# EAGLE design ltc (EAGLE 6.5.0)
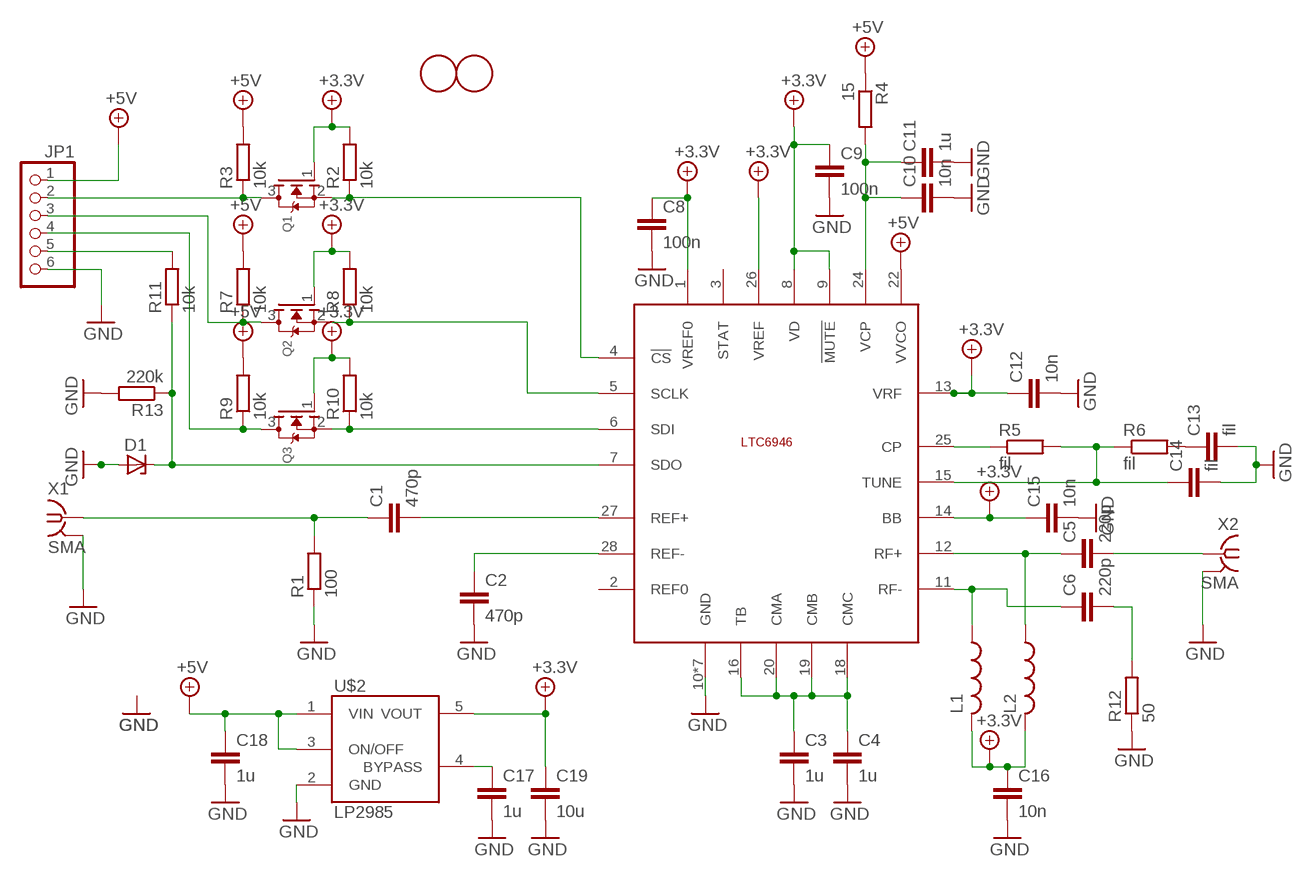
[diagram p0: schematic, sheet 1]

## Parts
C1  470p  C-EUC0603  [C0603]
C2  470p  C-EUC0603  [C0603]
C3  1u  C-EUC0603  [C0603]
C4  1u  C-EUC0603  [C0603]
C5  220p  C-EUC0603  [C0603]
C6  220p  C-EUC0603  [C0603]
C8  100n  C-EUC0603  [C0603]
C9  100n  C-EUC0603  [C0603]
C10  10n  C-EUC0603  [C0603]
C11  1u  C-EUC0603  [C0603]
C12  10n  C-EUC0603  [C0603]
C13  fil  C-EUC0603  [C0603]
C14  fil  C-EUC0603  [C0603]
C15  10n  C-EUC0603  [C0603]
C16  10n  C-EUC0603  [C0603]
C17  1u  C-EUC0603  [C0603]
C18  1u  C-EUC0603  [C0603]
C19  10u  C-EUC0603  [C0603]
D1  ZENER-DIODESOT23  [SOT23]
JP1  PINHD-1X6B  [1X06-BIG]
L1  L-USL2825P  [L2825P]
L2  L-USL2825P  [L2825P]
Q1  MOSFET-NREFLOW  [SOT23]
Q2  MOSFET-NREFLOW  [SOT23]
Q3  MOSFET-NREFLOW  [SOT23]
R1  100  R-EU_R0603  [R0603]
R2  10k  R-EU_R0603  [R0603]
R3  10k  R-EU_R0603  [R0603]
R4  15  R-EU_R0603  [R0603]
R5  fil  R-EU_R0603  [R0603]
R6  fil  R-EU_R0603  [R0603]
R7  10k  R-EU_R0603  [R0603]
R8  10k  R-EU_R0603  [R0603]
R9  10k  R-EU_R0603  [R0603]
R10  10k  R-EU_R0603  [R0603]
R11  10k  R-EU_R0603  [R0603]
R12  50  R-EU_R0603  [R0603]
R13  220k  R-EU_R0603  [R0603]
U$1  LTC6946  [QFN28-UFD]
U$2  LP2985AIM5-3.3  [SOT25]
U$3  FIDUCIAL  [FIDUCIAL_1MM]
U$4  FIDUCIAL  [FIDUCIAL_1MM]
X1  SMA  SMA-142-0711-821/826  [J502-ND-142-0711-821/826]
X2  SMA  SMA-142-0711-821/826  [J502-ND-142-0711-821/826]

## Nets
+4.1V: C8.1 C9.1 C12.1 C15.1 C16.1 C19.1 L1.2 L2.2 Q1.1(G) Q2.1(G) Q3.1(G) R2.2 R8.2 R10.2 U$1.1(VREF0) U$1.8(VD) U$1.9(!MUTE) U$1.13(VRF) U$1.14(BB) U$1.26(VREF) U$2.5(VOUT) ; supply symbol labelled +3.3V
+5V: C18.1 JP1.1 R3.2 R4.1 R7.2 R9.2 U$1.22(VVCO) U$2.1(VIN) U$2.3(ON/OFF)
BYPASS: C17.1 U$2.4(BYPASS)
GND: C2.2 C3.2 C4.2 C8.2 C9.2 C10.2 C11.2 C12.2 C13.2 C14.2 C15.2 C16.2 C17.2 C18.2 C19.2 D1.1(A) JP1.6 R1.1 R12.1 R13.2 U$1.10(GND) U$1.17(GND) U$1.21(GND) U$1.23(GND) U$1.29(GND) U$1.29@1(GND) U$1.29@2(GND) U$2.2(GND) X1.G@1 X1.G@2 X1.G@3 X1.G@4 X2.G@1 X2.G@2 X2.G@3 X2.G@4
N$1: C2.1 U$1.28(REF-)
N$2: C1.2 U$1.27(REF+)
N$3: C1.1 R1.2 X1.1
N$4: C3.1 C4.1 U$1.16(TB) U$1.18(CMC) U$1.19(CMB) U$1.20(CMA)
N$5: C6.2 R12.2
N$6: Q1.2(S) R2.1 U$1.4(!CS)
N$7: JP1.2 Q1.3(D) R3.1
N$8: C10.1 C11.1 R4.2 U$1.24(VCP)
N$9: Q2.2(S) R8.1 U$1.5(SCLK)
N$10: JP1.3 Q2.3(D) R7.1
N$11: C13.1 R6.2
N$12: C14.1 R5.2 R6.1 U$1.15(TUNE)
N$13: R5.1 U$1.25(CP)
N$14: C6.1 L1.1 U$1.11(RF-)
N$15: Q3.2(S) R10.1 U$1.6(SDI)
N$16: C5.1 L2.1 U$1.12(RF+)
N$17: JP1.4 Q3.3(D) R9.1
N$18: D1.3(C) R11.1 R13.1 U$1.7(SDO)
N$19: C5.2 X2.1
N$21: JP1.5 R11.2
Unconnected: U$1.2(REF0) U$1.3(STAT)

## Library data of the parts
C1-C6 C8-C19 = rcl:C-EU: CAPACITOR, European symbol
D1 = diode:ZENER-DIODE: Z-Diode
JP1 = adafruit:PINHD-1X6: PIN HEADER
L1 L2 = rcl:L-US: INDUCTOR, American symbol
Q1-Q3 = adafruit:MOSFET-N: N-Channel Mosfet 2N7002E - 60V 260mA SOT23 [Digikey: 2N7002ET1GOSTR-ND] - REEL BSH103 - 30V 850mA SOT23 [Digikey: 568-5013-1-ND]
R1-R13 = rcl:R-EU_: RESISTOR, European symbol
U$1 = linear-technology-lt3669:LTC6946
U$2 = LP2985:LP2985: LP2985-N Micropower 150 mA Low-Noise Ultra Low-Dropout Regulator
U$3 U$4 = adafruit:FIDUCIAL: For use by pick and place machines to calibrate the vision/machine, 1mm By microbuilder.eu
X1 X2 = con-coax:SMA-: SMA 50 Ohm End Launch Jack Receptacle - Round Contact Johnson Components Source: www.johnsoncomponents.com .. J502-ND.pdf; MF: JOHNSON COMPONENTS; MPN: 142-0711-821; OC_FARNELL: 1019328; OC_NEWARK: 16F3627

## Board
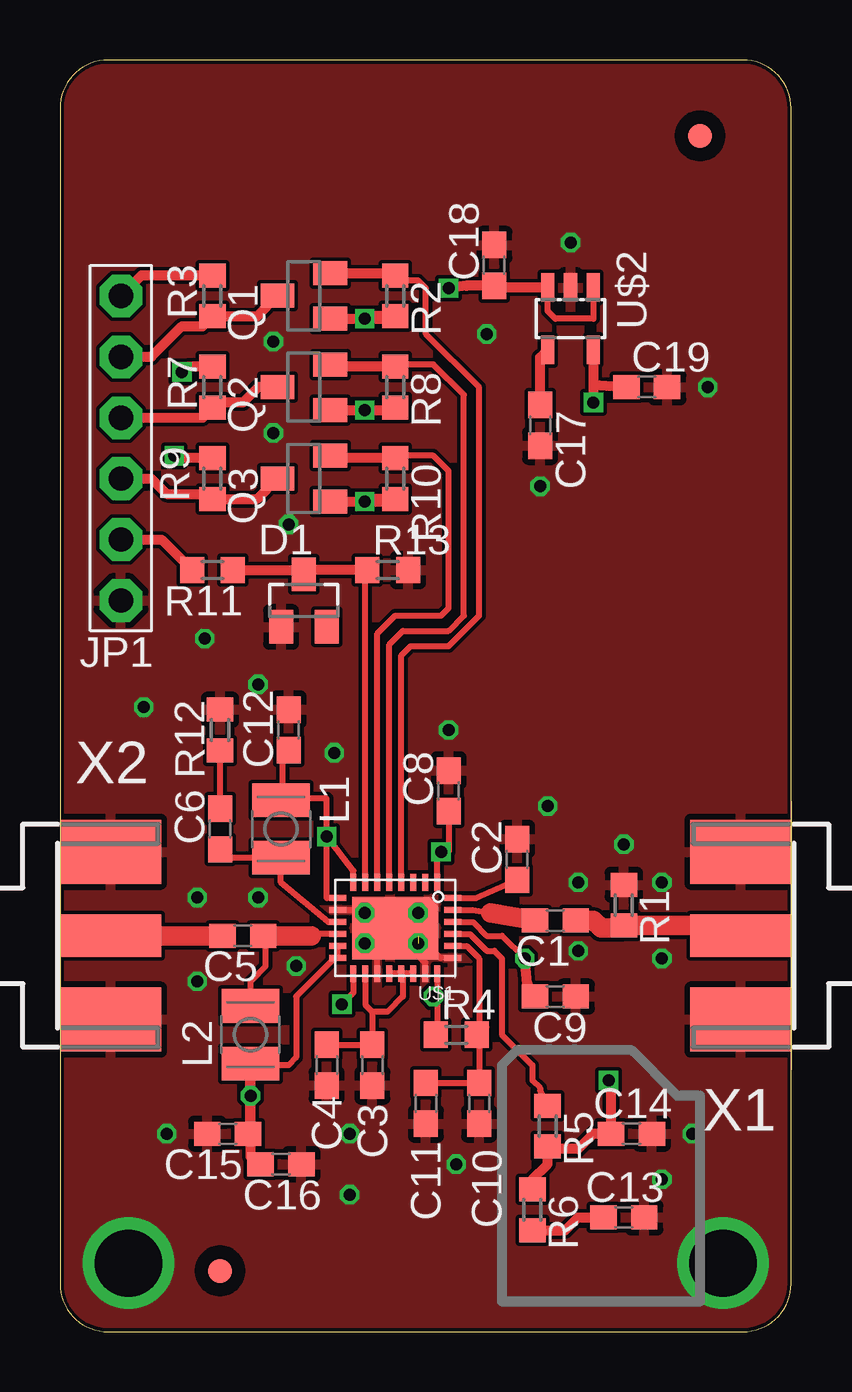
[diagram p1: board, top side]
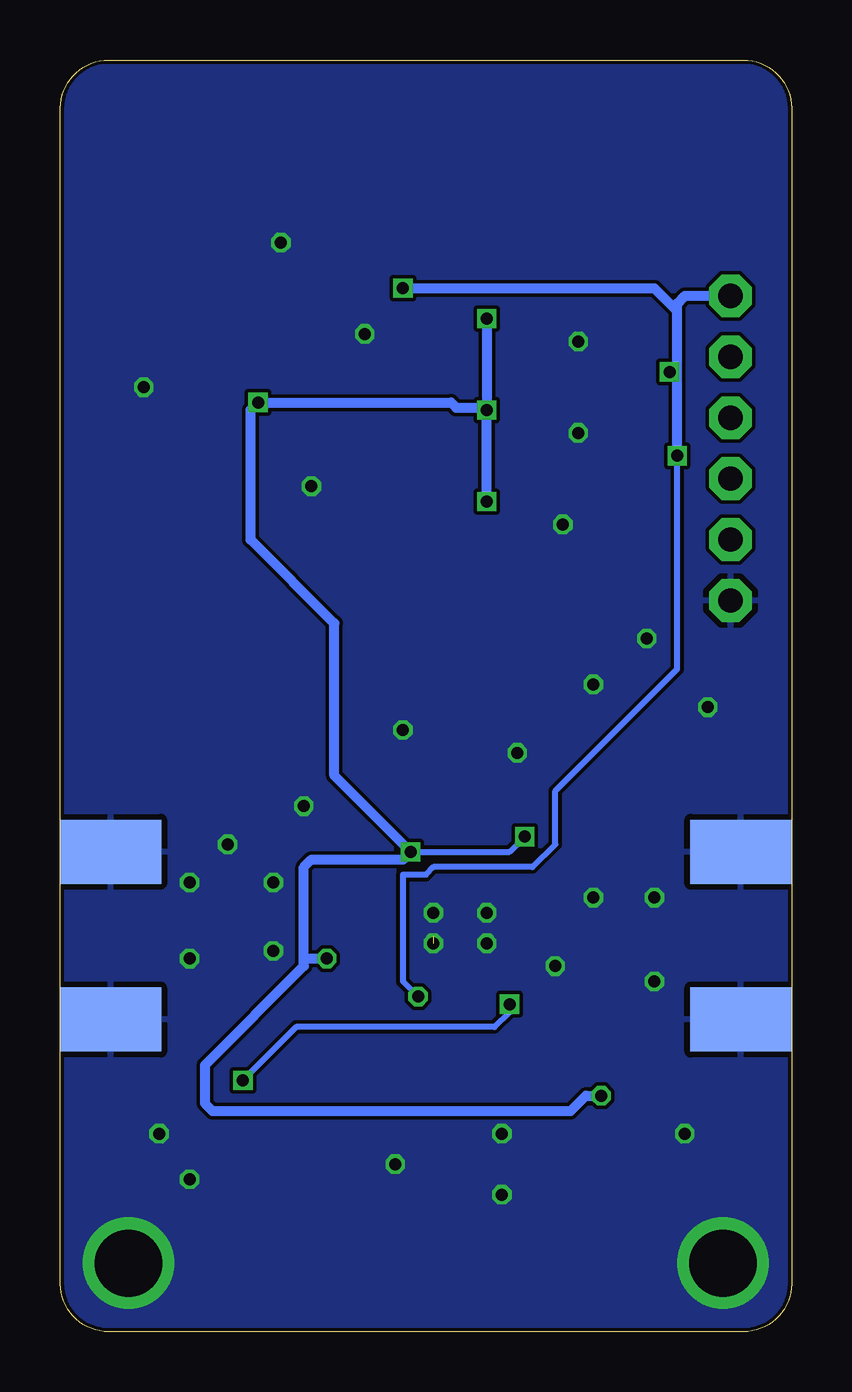
[diagram p2: board, bottom side, seen from below]

Size 30.48 x 53.01 mm. Coordinates in mm from the lower left corner, seen from the top.
Outline: 0,51.01 0,2 arc90 2,0 28.46,0 arc90 30.46,2 30.46,51.01 arc90 28.46,53.01 2,53.01 arc90 0,51.01
Copper layers (1*16): Top 0.035mm / dielectric 1.5mm / Bottom 0.035mm
Design rules "hackvana": minimum track width 6mil, minimum drill 0.3mm, track to track 6mil, track to pad 6mil, pad to pad 6mil, via to via 6mil, smd to smd 0mil, copper to edge 6mil, drill to drill 6mil, minimum pad ring 10mil, minimum via ring 6mil, stop-mask expansion 2mil, vias tented up to drill 100mil, thermal gap 10mil

### Footprints (pad centres in the part's own frame; a part is rotated, then mirrored left to right if it is on the bottom)
C0603 = smd 1.1 x 1: 1 -0.85,0; 2 0.85,0
SOT23 = smd 1 x 1.4: 1 -0.95,-1.1; 2 0.95,-1.1; 3 0,1.1
1X06-BIG = drill 1.016 pad 1.778 octagon: 1 -6.35,0; 2 -3.81,0; 3 -1.27,0; 4 1.27,0; 5 3.81,0; 6 6.35,0
L2825P = smd 1.4 x 2.4: 1 -1.2,0; 2 1.2,0
R0603 = smd 1 x 1.1: 1 -0.85,0; 2 0.85,0
QFN28-UFD = smd 0.25 x 0.7: 1 -1.75,-1.9; 2 -1.25,-1.9; 3 -0.75,-1.9; 4 -0.25,-1.9; 5 0.25,-1.9; 6 0.75,-1.9; 7 1.25,-1.9; 8 1.75,-1.9; 15 1.75,1.9; 16 1.25,1.9; 17 0.75,1.9; 18 0.25,1.9; 19 -0.25,1.9; 20 -0.75,1.9; 21 -1.25,1.9; 22 -1.75,1.9 | smd 0.7 x 0.25: 9 2.4,-1.25; 10 2.4,-0.75; 11 2.4,-0.25; 12 2.4,0.25; 13 2.4,0.75; 14 2.4,1.25; 23 -2.4,1.25; 24 -2.4,0.75; 25 -2.4,0.25; 26 -2.4,-0.25; 27 -2.4,-0.75; 28 -2.4,-1.25 | smd 3.2 x 2.6: 29 0.2,0 | smd 0.4 x 2.2: 29@1 -1.6,0.2 | smd 0.56 x 0.56 rotated 45: 29@2 -1.4,-0.9
SOT25 = smd 0.55 x 1.2: 1 -0.95,-1.3; 2 0,-1.3; 3 0.95,-1.3; 4 0.95,1.3; 5 -0.95,1.3
FIDUCIAL_1MM = smd 1 x 1: 1 0,0
J502-ND-142-0711-821/826 = smd 4.191 x 1.778: 1 2.115,0 | smd 4.191 x 2.667: G@1 2.115,3.495; G@2 2.115,-3.495 | smd 4.191 x 2.667 bottom: G@3 2.115,3.495; G@4 2.115,-3.495

### Placement (x,y rotation side)
C1  20.64,17.14 180 top
C2  19.05,19.68 90 top
C3  13.02,11.11 270 top
C4  11.11,11.11 270 top
C5  7.62,16.51 180 top
C6  6.67,20.95 90 top
C8  16.19,22.54 90 top
C9  20.64,13.97 0 top
C10  17.46,9.53 270 top
C11  15.24,9.53 270 top
C12  9.53,25.08 90 top
C13  23.5,4.76 0 top
C14  23.81,8.26 0 top
C15  6.99,8.26 180 top
C16  9.21,6.99 0 top
C17  20,37.78 270 top
C18  18.1,44.45 90 top
C19  24.45,39.37 0 top
D1  10.16,30.48 0 top
JP1  2.54,36.83 270 top
L1  9.21,20.95 90 top
L2  7.94,12.38 270 top
Q1  10.16,43.18 90 top
Q2  10.16,39.37 90 top
Q3  10.16,35.56 90 top
R1  23.5,17.78 270 top
R2  13.97,43.18 270 top
R3  6.35,43.18 90 top
R4  16.51,12.38 0 top
R5  20.32,8.57 270 top
R6  19.68,5.08 270 top
R7  6.35,39.37 90 top
R8  13.97,39.37 270 top
R9  6.35,35.56 90 top
R10  13.97,35.56 270 top
R11  6.35,31.75 180 top
R12  6.67,25.08 270 top
R13  13.65,31.75 0 top
U$1  13.97,16.83 180 top
U$2  21.27,42.23 180 top
U$3  6.67,2.54 0 top
U$4  26.67,49.85 0 top
X1  30.48,16.51 180 top
X2  0,16.51 0 top

### Tracks (layer width: path | path; a pad name or v marks a point on that pad's centre or on a via)
+4.1V  (via drill 0.5)
  Top 0.254: U$1.8 12.22,19.21 v11.11,20.64 | U$1.9 11.13,18.08 11.11,18.1 v11.11,20.64 | U$1.1 15.72,19.85 v15.88,20 16.19,20 C8.1 | v11.11,20.64 11.11,22.23 9.28,22.23 | 9.28,22.23 L1.2 | C15.1 7.83,11.4 L2.2 7.69,11.11 9.53,11.11 9.84,11.43 9.84,13.97 11.45,15.58 U$1.14 U$1.13 | U$1.26 17.21,17.08 17.78,16.51 18.41,16.51 v19.37,15.56 | 9.28,22.23 9.28,23.98 C12.1
  Top 0.406: Q1.1 13.87,42.23 R2.2 12.8,42.33 v12.7,42.23 | Q3.1 13.87,34.61 R10.2 12.7,34.71 v12.7,34.61 | Q2.1 v12.7,38.42 | v12.7,38.42 13.87,38.42 R8.2 13.97,38.42 v12.7,38.42 | U$2.5 22.22,39.48 | 22.22,39.48 C19.1 | 22.22,39.48 v22.22,38.74 v22.23,38.73 | C9.1 19.47,14.5 v19.37,15.56 | C16.1 8.36,7.2 7.94,7.3 v7.94,9.84 L2.2
  Bottom 0.254: v15.88,20 11.75,20 v11.11,20.64
  Bottom 0.406: v12.7,42.23 v12.7,38.42 | v12.7,34.61 v12.7,38.42 | v12.7,38.42 12.8,38.52 R8.2 14.19,38.73 v22.23,38.73 22.54,38.42 22.54,33.02 19.05,29.53 19.05,23.18 v15.88,20 16.19,19.68 20,19.68 20.32,19.37 20.32,15.56 | v7.94,9.84 8.57,9.84 9.21,9.21 24.13,9.21 24.45,9.53 24.45,11.11 20.32,15.24 20.32,15.56 | 20.32,15.56 v19.37,15.56
+5V  (via drill 0.5)
  Top 0.254: U$2.1 22.22,42.23 22.23,42.23 20.64,42.23 20.32,42.55 U$2.3 | R4.1 15.72,12.44 U$1.22 15.72,14.13 v15.56,13.97
  Top 0.406: R3.2 3.39,44.03 JP1.1 | R7.2 5.29,40.22 v5.08,40.01 | R9.2 4.87,36.41 v4.76,36.51 | U$2.3 18.49,43.53 C18.1 16.93,43.6 v16.19,43.5
  Bottom 0.254: v4.76,36.51 4.76,27.62 9.84,22.54 9.84,20.32 10.79,19.37 14.92,19.37 15.24,19.05 16.19,19.05 16.19,14.61 v15.56,13.97
  Bottom 0.406: v5.08,40.01 4.76,40.32 | 4.76,40.32 4.76,42.55 | 4.76,42.55 4.76,42.86 4.45,43.18 JP1.1 | v4.76,36.51 4.76,40.32 | v16.19,43.5 5.71,43.5 4.76,42.55
BYPASS
  Top 0.406: C17.1 20,40.61 U$2.4
GND  (via drill 0.5, 2.8)  (1 unrouted)
  Top 0.254: U$1.17 13.22,16.28 U$1.29 | U$1.23 15.86,15.58 14.92,16.51 14.09,16.51 U$1.29 | U$1.10 13.02,17.58 U$1.29 | U$1.21 15.22,15.38 U$1.29
  Top 0.813: U$1.29@2 15.19,17.73 v14.92,17.46
  other vias: 9.84,15.24 12.7,17.46 12.7,16.19 14.92,16.19 8.26,18.1 3.49,26.04 6.03,28.89 11.43,24.13 5.71,14.61 5.71,18.1 9.53,33.66 8.89,37.47 8.89,41.27 17.78,41.59 23.5,20.32 21.59,15.88 21.59,18.73 16.19,25.08 20.32,21.91 20,35.24 26.99,39.37 21.27,45.4 12.06,5.71 4.45,8.26 25.08,6.35 2.86,2.86 27.62,2.86 16.51,6.99 26.35,8.26 25.08,15.56 25.08,18.73 12.06,8.26 8.26,26.99
  pour Top: 0,53.34 31.75,53.34 31.75,-1.27 0,-1.27
  pour Bottom: -1.27,54.29 32.38,54.29 32.38,-1.91 -1.27,-1.91
N$1
  Top 0.254: U$1.28 17.34,18.08 C2.1
N$2
  Top 0.254: U$1.27 17.19,17.58 17.94,17.46
  Top 0.813: C1.2 17.94,17.46
N$3
  Top 0.813: C1.1 22.23,17.14 22.54,16.83 23.39,16.83 R1.2 27.5,16.93 X1.1
N$4
  Top 0.254: C4.1 C3.1 13.02,13.34 | U$1.20 U$1.19 U$1.18 14.28,14.93 14.29,14.92 14.29,13.97 13.65,13.34 13.02,13.34 | U$1.16 12.72,13.63 13.02,13.34
N$5
  Top 0.254: C6.2 R12.2
N$6
  Top 0.254: U$1.4 14.22,28.19 14.61,28.57 16.19,28.57 17.46,29.84 17.46,39.37 15.24,41.59 15.24,43.5 14.92,43.81 14.19,43.81 R2.1
  Top 0.406: Q1.2 13.87,44.13 R2.1
N$7
  Top 0.406: JP1.2 3.81,40.64 5.08,41.91 5.93,41.91 R3.1 8.21,42.33 Q1.3
N$8
  Top 0.254: 17.46,12.38 R4.2 17.46,12.48 17.46,15.56 16.94,16.08 U$1.24 | 17.46,12.38 17.78,12.7 | 17.46,12.38 C10.1 C11.1
N$9
  Top 0.254: U$1.5 13.72,28.64 14.29,29.21 16.19,29.21 16.83,29.84 16.83,39.05 15.56,40.32 14.07,40.32 R8.1
  Top 0.406: R8.1 11.36,40.22 Q2.2
N$10
  Top 0.406: JP1.3 5.93,38.1 R7.1 6.57,38.73 7.62,38.73 8.26,39.37 Q2.3
N$11
  Top 0.406: R6.2 21.06,4.23 21.59,4.76 C13.1
N$12  (via drill 0.5)
  Top 0.254: U$1.15 12.22,14.12 v11.75,13.65 | R5.2 20.74,8.04
  Top 0.406: R6.1 19.68,6.35 20.32,6.99 R5.2 20.42,7.62 21.59,7.62 22.23,8.26 C14.1 22.96,10.38 v22.86,10.48
  Bottom 0.254: v11.75,13.65 11.75,13.34 12.38,12.7 20.64,12.7 v22.86,10.48
N$13
  Top 0.254: U$1.25 17.08,16.58 17.78,15.88 18.1,15.88 18.41,15.56 18.41,12.38 19.68,11.11 19.68,10.48 20,10.16 20,10.06 R5.1
N$14
  Top 0.254: U$1.11 11.18,17.08 9.21,18.73 L1.1 7.02,19.75 C6.1
N$15
  Top 0.254: U$1.6 13.22,29.09 13.97,29.84 15.88,29.84 16.19,30.16 16.19,35.88 15.56,36.51 14.07,36.51 R10.1
  Top 0.406: R10.1 11.36,36.41 Q3.2
N$16
  Top 0.254: U$1.12 8.86,16.58 C5.1 8.57,16.41 8.57,15.24 7.94,14.61 L2.1
  Top 0.813: C5.1 10.48,16.51
N$17
  Top 0.406: JP1.4 3.81,35.56 4.45,34.92 6.13,34.92 R9.1 8.21,34.71 Q3.3
N$18
  Top 0.254: U$1.7 12.72,31.67 R13.1
  Top 0.406: R11.1 9.99,31.75 D1.3 10.33,31.75 R13.1
N$19
  Top 0.813: X2.1 C5.2
N$21
  Top 0.406: JP1.5 4.23,33.02 R11.2

### Text on the board
tDocu: LTC6946 BOB | REFERENCE | RF OUT | LOOP FILTER